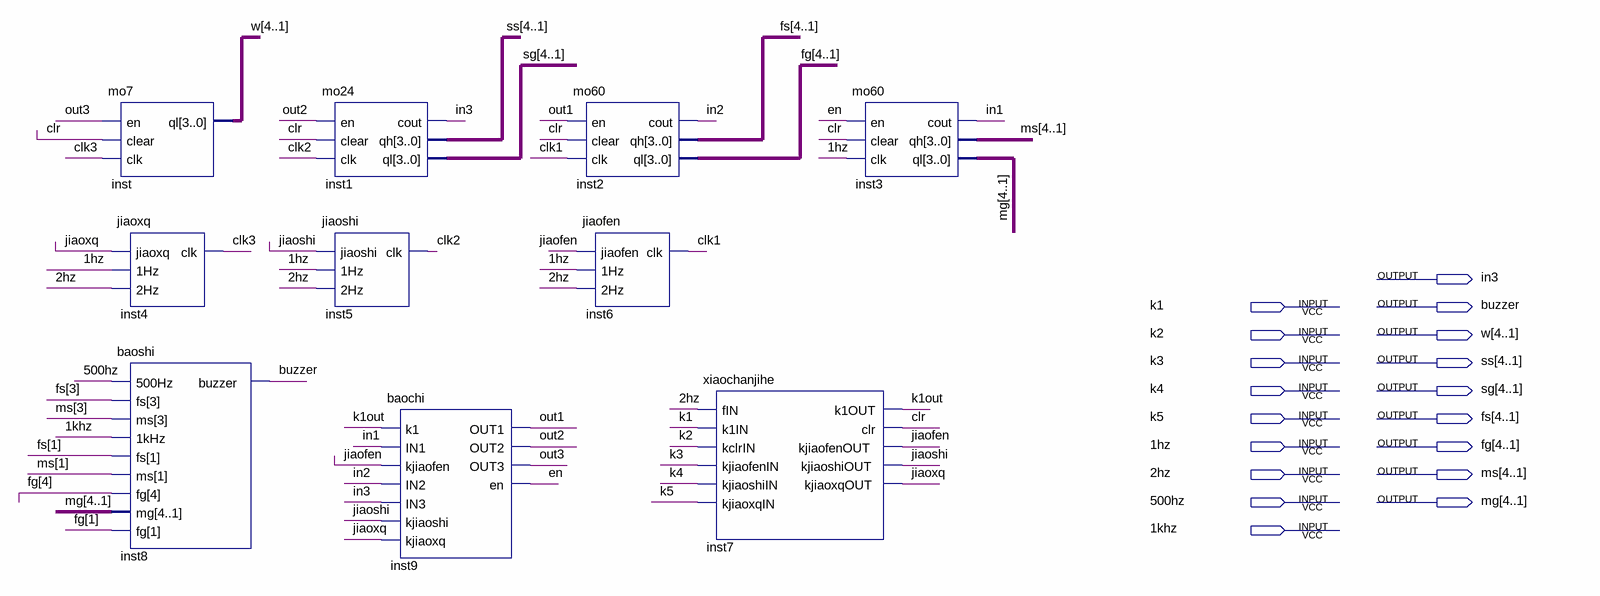
[diagram p0: schematic sheet]
// Quartus schematic jishi.bdf as structural Verilog: 10 symbols, 18 pins
module jishi (
  input  k1,
  input  k2,
  input  k3,
  input  k4,
  input  k5,
  input  \1hz ,
  input  \2hz ,
  input  \500hz ,
  input  \1khz ,
  output in3,
  output buzzer,
  output [4:1] w,
  output [4:1] ss,
  output [4:1] sg,
  output [4:1] fs,
  output [4:1] fg,
  output [4:1] ms,
  output [4:1] mg
);

  wire clk1, clk2, clk3, clr, en, in1, in2, jiaofen, jiaoshi, jiaoxq, k1out, out1, out2, out3;

  mo7 inst (.en(out3), .clear(clr), .clk(clk3), .ql(w));
  jiaoxq inst4 (.jiaoxq(jiaoxq), .\1Hz (\1hz ), .\2Hz (\2hz ), .clk(clk3));
  baoshi inst8 (
    .\500Hz (\500hz ), .fs({fs[3], fs[1]}), .ms({ms[3], ms[1]}), .\1kHz (\1khz ), .fg({fg[4], fg[1]}),
    .mg(mg), .buzzer(buzzer));
  mo24 inst1 (.en(out2), .clear(clr), .clk(clk2), .cout(in3), .qh(ss), .ql(sg));
  jiaoshi inst5 (.jiaoshi(jiaoshi), .\1Hz (\1hz ), .\2Hz (\2hz ), .clk(clk2));
  baochi inst9 (
    .k1(k1out), .IN1(in1), .kjiaofen(jiaofen), .IN2(in2), .IN3(in3), .kjiaoshi(jiaoshi), .kjiaoxq(jiaoxq),
    .OUT1(out1), .OUT2(out2), .OUT3(out3), .en(en));
  mo60 inst2 (.en(out1), .clear(clr), .clk(clk1), .cout(in2), .qh(fs), .ql(fg));
  jiaofen inst6 (.jiaofen(jiaofen), .\1Hz (\1hz ), .\2Hz (\2hz ), .clk(clk1));
  xiaochanjihe inst7 (
    .fIN(\2hz ), .k1IN(k1), .kclrIN(k2), .kjiaofenIN(k3), .kjiaoshiIN(k4), .kjiaoxqIN(k5), .k1OUT(k1out),
    .clr(clr), .kjiaofenOUT(jiaofen), .kjiaoshiOUT(jiaoshi), .kjiaoxqOUT(jiaoxq));
  mo60 inst3 (.en(en), .clear(clr), .clk(\1hz ), .cout(in1), .qh(ms), .ql(mg));
endmodule
